# Altium project old_singleboard_now_mcu.PrjPcb (part 1 of 4)
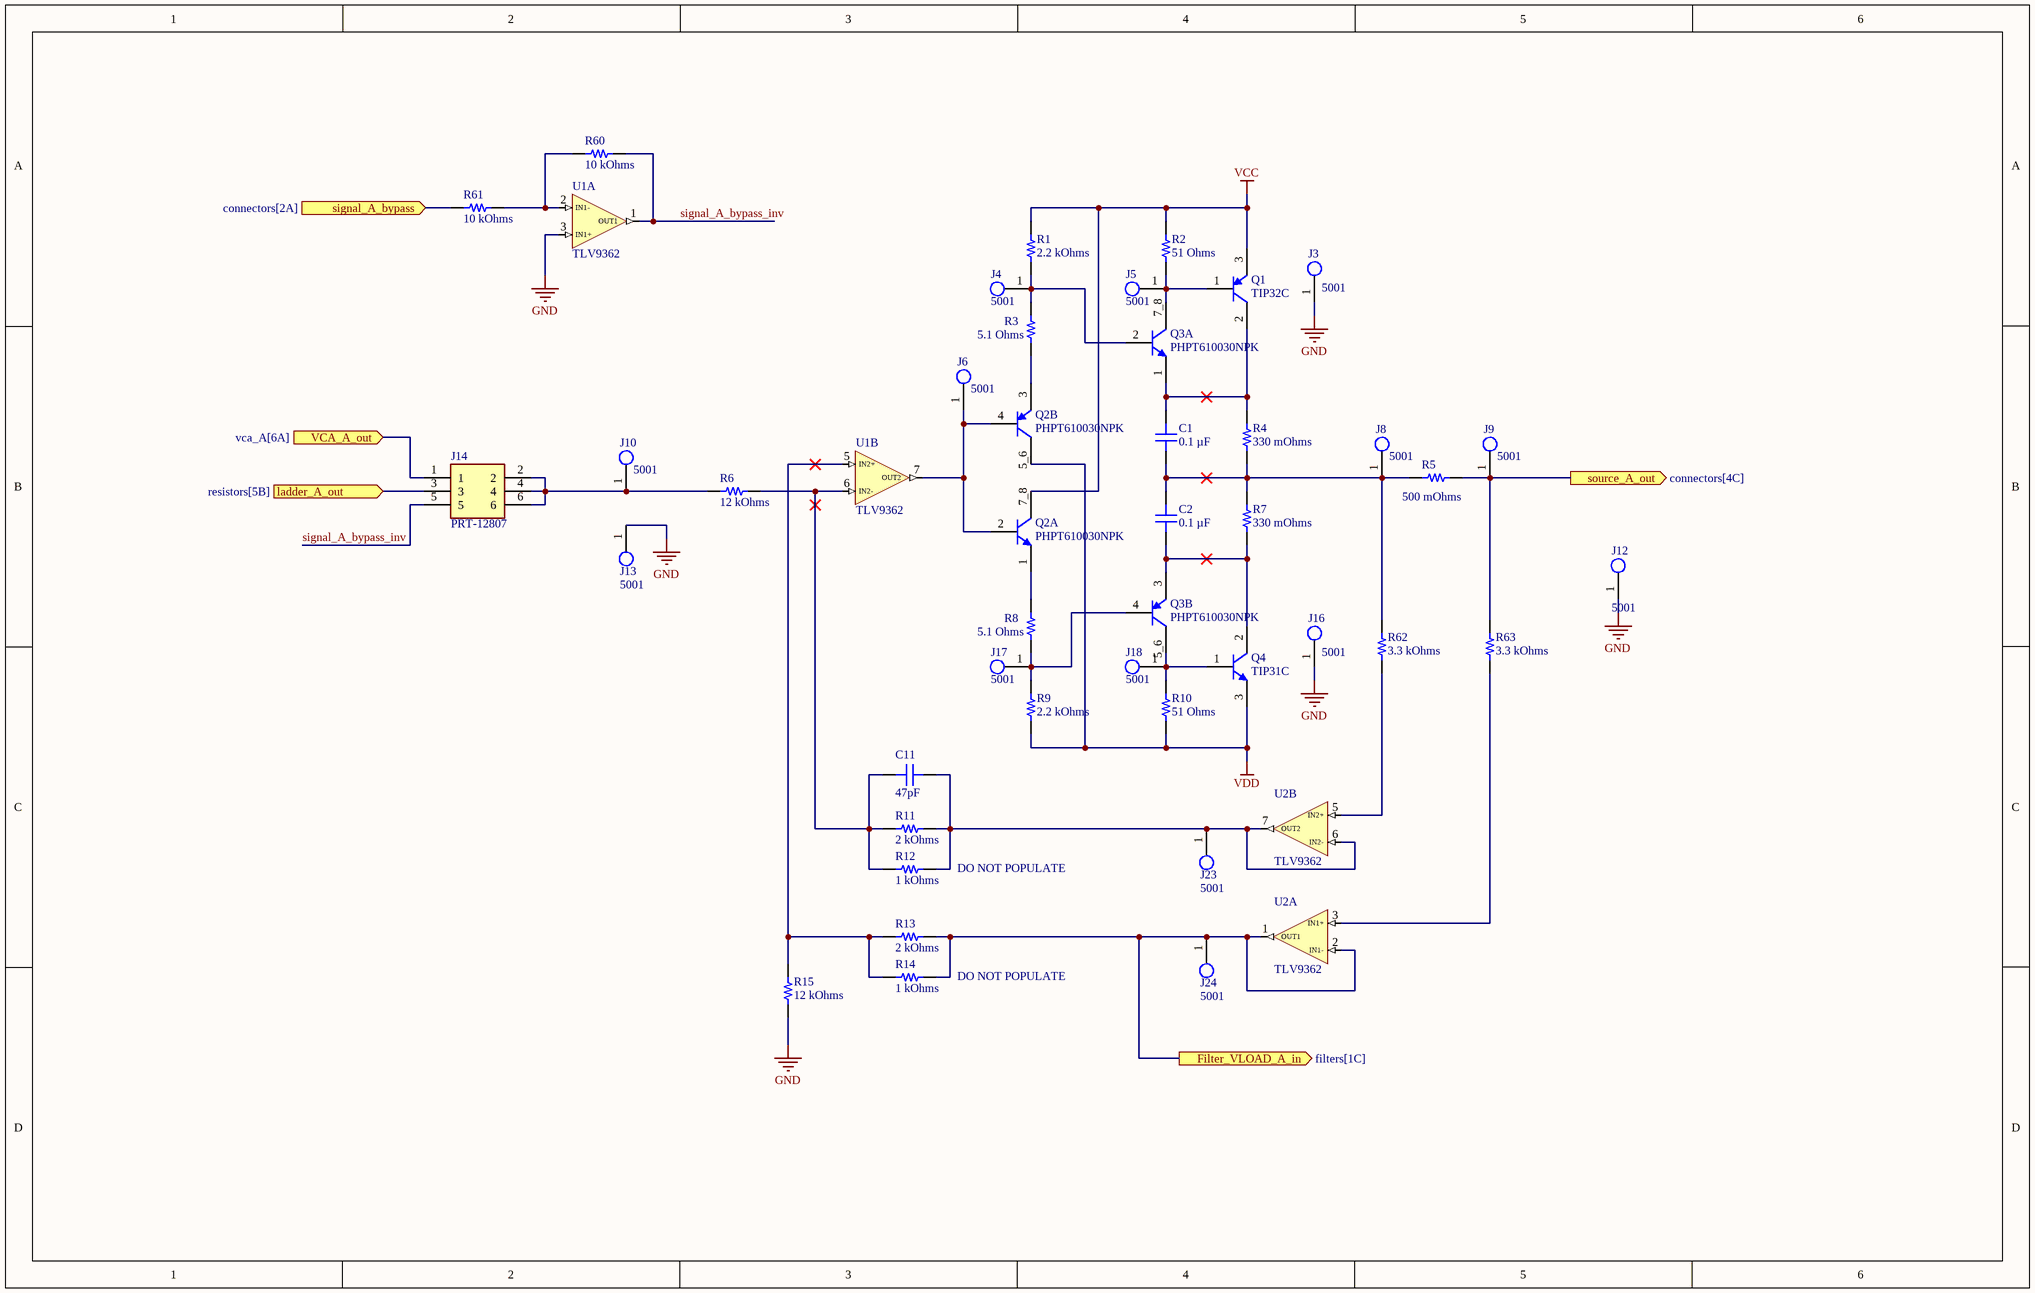
[diagram p0: source_A.SchDoc]
12 sheets, 431 parts. Net scope: flat (ports and power ports of the same name join across sheets).
Board file: source.PcbDoc
Sheets:
  source_A.SchDoc
  source_B.SchDoc
  vca_A.SchDoc
  vca_B.SchDoc
  filters.SchDoc
  power.SchDoc
  MCU.SchDoc
  LDO.SchDoc
  misc.SchDoc
  connectors.SchDoc
  LCD.SchDoc
  resistors.SchDoc

## Sheet source_A.SchDoc
size 381 x 241 mm; SheetNumber: 1; SheetTotal: 12

### Parts
(Parts that share a designator on the sheet are numbered #1, #2 ... from top to bottom, then left to right.)
C1#1  0.1 µF  [CAP 1206_3216 - 0.8MM]
C2#1  0.1 µF  [CAP 1206_3216 - 0.8MM]
C11#1  47pF  [CAP 1206_3216 - 1.8MM]
J3#1  5001  [FP-5001-MFG]
J4#1  5001  [FP-5001-MFG]
J5#1  5001  [FP-5001-MFG]
J6  5001  [FP-5001-MFG]
J8  5001  [FP-5001-MFG]
J9  5001  [FP-5001-MFG]
J10  5001  [FP-5001-MFG]
J12  5001  [FP-5001-MFG]
J13  5001  [FP-5001-MFG]
J14  PRT-12807  [HDRV6W82P254_2X3_762X500X884P]
J16  5001  [FP-5001-MFG]
J17  5001  [FP-5001-MFG]
J18  5001  [FP-5001-MFG]
J23  5001  [FP-5001-MFG]
J24  5001  [FP-5001-MFG]
Q1#1  TIP32C  [ONSC-TO-220-3-221A-09]
Q2#1  PHPT610030NPK  [TRANS_BUK9K18-40E,115]  (parts A,B of 2)
Q3  PHPT610030NPK  [TRANS_BUK9K18-40E,115]  (parts A,B of 2)
Q4  TIP31C  [ONSC-TO-220-3-221A-09]
R1#1  2.2 kOhms  [RES 1206_3216]
R2#1  51 Ohms  [RES 1206_3216]
R3#1  5.1 Ohms  [RES 1206_3216]
R4#1  330 mOhms  [STACKPOLE CSR2512]
R5#1  500 mOhms  [STACKPOLE CSR2512]
R6#1  12 kOhms  [RES 1206_3216]
R7#1  330 mOhms  [STACKPOLE CSR2512]
R8#1  5.1 Ohms  [RES 1206_3216]
R9#1  2.2 kOhms  [RES 1206_3216]
R10#1  51 Ohms  [RES 1206_3216]
R11#1  2 kOhms  [RES 1206_3216]
R12#1  1 kOhms  [RES 1206_3216]
R13#1  2 kOhms  [RES 1206_3216]
R14#1  1 kOhms  [RES 1206_3216]
R15#1  12 kOhms  [RES 1206_3216]
R60  10 kOhms  [YAGEO RES 1206_3216]
R61  10 kOhms  [YAGEO RES 1206_3216]
R62  3.3 kOhms  [YAGEO RES 1206_3216]
R63  3.3 kOhms  [YAGEO RES 1206_3216]
U1#1  TLV9362  [SOIC8-127P600X175-8N]  (parts A,B of 3)
U2#1  TLV9362  [SOIC8-127P600X175-8N]  (parts A,B of 3)

### Ports
Filter_VLOAD_A_in (out, see filters[1C]), ladder_A_out (in, see resistors[5B]), signal_A_bypass (in, see connectors[2A]), source_A_out (out, see connectors[4C]), VCA_A_out (in, see vca_A[6A])

### Nets
GND: J3#1.1 J12.1 J13.1 J16.1 R15#1.1 U1#1.3(IN1+)
VCC: Q1#1.3(E) Q2#1.7_8(C1) R1#1.2 R2#1.2
VDD: Q2#1.5_6(C2) Q4.3(E) R9#1.1 R10#1.1
signal_A_bypass_inv: J14.5 R60.2 U1#1.1(OUT1)
NetC1#1_1: C1#1.1 C2#1.2 J8.1 R4#1.1 R5#1.2 R7#1.2 R62.1
NetC1#1_2: C1#1.2 Q1#1.2(C) Q3.1(E1) R4#1.2
NetC2#1_1: C2#1.1 Q3.3(E2) Q4.2(C) R7#1.1
NetC11#1_1: C11#1.1 R6#1.1 R11#1.1 R12#1.1 U1#1.6(IN2-)
NetC11#1_2: C11#1.2 J23.1 R11#1.2 R12#1.2 U2#1.6(IN2-) U2#1.7(OUT2)
NetD6#2_2: J24.1 R13#1.2 R14#1.2 U2#1.1(OUT1) U2#1.2(IN1-) ; port Filter_VLOAD_A_in
NetD9_2: J9.1 R5#1.1 R63.1 ; port source_A_out
NetJ4#1_1: J4#1.1 Q3.2(B1) R1#1.1 R3#1.2
NetJ5#1_1: J5#1.1 Q1#1.1(B) Q3.7_8(C1) R2#1.1
NetJ6_1: J6.1 Q2#1.2(B1) Q2#1.4(B2) U1#1.7(OUT2)
NetJ10_1: J10.1 J14.2 J14.4 J14.6 R6#1.2
NetJ14_1: J14.1 ; port VCA_A_out
NetJ14_3: J14.3 ; port ladder_A_out
NetJ17_1: J17.1 Q3.4(B2) R8#1.1 R9#1.2
NetJ18_1: J18.1 Q3.5_6(C2) Q4.1(B) R10#1.2
NetJ95_1: R61.2 ; port signal_A_bypass
NetQ2#1_1: Q2#1.1(E1) R8#1.2
NetQ2#1_3: Q2#1.3(E2) R3#1.1
NetR13#1_1: R13#1.1 R14#1.1 R15#1.2 U1#1.5(IN2+)
NetR60_1: R60.1 R61.1 U1#1.2(IN1-)
NetR62_2: R62.2 U2#1.5(IN2+)
NetR63_2: R63.2 U2#1.3(IN1+)

### Notes on the sheet
- DO NOT POPULATE

### Library data of the parts
C1#1 C2#1 = 885012208087: CAP CER 0.1UF 50V X7R 1206; manufacturer: Würth Elektronik; Tolerance: ±10%; Part Number: 885012208087; Capacitance: 0.1 µF; Applications: General Purpose; componentlink1description: Datasheet; componentlink1url: https://katalog.we-online.de/pbs/datasheet/885012208087.pdf; componentlink2description: DigiKey Link; componentlink2url: https://www.digikey.com/en/products/detail/würth-elektronik/885012208087/5453982; Device Package: 1206 (3216 Metric); lastupdated: 6/4/2024 19:10:27; Lifecycle Status: Active; Minimum Order: 1; Mounting Type: Surface Mount, MLCC; Operating Temperature: -55°C ~ 125°C; Package / Case: 1206 (3216 Metric); packaging: TapeAndReel; partid: 20879; Part Status: Active; price: 0.06; series: WCAP-CSGP; Size / Dimension: 0.126" L x 0.063" W (3.20mm x 1.60mm); Supplier 1: DigiKey; Supplier Part Number 1: 732-8127-1-ND; Temperature Coefficient: X7R; Thickness (Max): 0.035" (0.90mm); value: 0.1 µF; Voltage - Rated: 50V
C11#1 = 1206AA470KAT1A: CAP CER 47PF 1KV C0G/NP0 1206; manufacturer: AVX Corporation; Temperature Coefficient: C0G, NP0; Tolerance: ±10%; Voltage - Rated: 1000V (1kV); Part Number: 1206AA470KAT1A; Capacitance: 47pF; Applications: General Purpose; componentlink1description: Datasheet; componentlink1url: http://datasheets.avx.com/AVX-HV_MLCC.pdf; componentlink2description: DigiKey Link; componentlink2url: http://digikey.com/product-detail/en/avx-corporation/1206AA470KAT1A/478-2949-1-ND/808148; Device Package: 1206 (3216 Metric); Features: High Voltage; lastupdated: 9/2/2020 01:05:31; Lifecycle Status: Active; Minimum Order: 1; Mounting Type: Surface Mount, MLCC; Operating Temperature: -55°C ~ 125°C; Package / Case: 1206 (3216 Metric); packaging: TapeAndReel; partid: 21825; Part Status: Active; price: 0.11; series: -; Size / Dimension: 0.130" L x 0.063" W (3.30mm x 1.60mm); Supplier 1: DigiKey; Supplier Part Number 1: 478-2949-1-ND; Thickness (Max): 0.071" (1.80mm); value: 47pF
J3#1 J4#1 J5#1 J6 J8-J10 J12 J13 J16-J18 J23 J24 = CMP-2000-05181-2: PC TEST POINT MINIATURE BLACK; Body Material: Bronze; Plating: Silver; Inside Diameter: 1.27mm; Hole Diameter: 1.6mm; Number of Ports: 1; Outside Diameter: 2.54mm; Insulation: Insulated; Insulation Material: Nylon; Mount: Through Hole; RoHS Compliant: Yes; Series: THM; Height: 0.3inch; Termination: Through Hole; Material: Nylon; Packaging: Bulk; Contact Material: Bronze; REACH SVHC: No SVHC; Contact Plating: Silver; Orientation: Straight; Lead Free: Lead Free; Package Quantity: 100; Length: 7.62mm; Flammability Rating: UL94 V-0; Number of Contacts: 1; Diameter: 2.54mm; Housing Color: Black; Color: Black
J14 = PRT-12807: Connector; Manufacturer_Name: SparkFun; Datasheet Link: https://cdn.sparkfun.com/datasheets/Prototyping/00989.pdf; Height: 8.84mm; Manufacturer_Part_Number: PRT-12807; Mouser Part Number: 474-PRT-12807; Mouser Price/Stock: https://www.mouser.co.uk/ProductDetail/SparkFun/PRT-12807?qs=WyAARYrbSnYnpz4kKzOm4A%3D%3D; Arrow Part Number: PRT-12807; Arrow Price/Stock: https://www.arrow.com/en/products/prt-12807/sparkfun-electronics
Q1#1 = TIP32C: Complementary Silicon Plastic Power Transistor, 3-Pin TO-220, Tube; Manufacturer: On Semiconductor; fT Min (MHz): 3; Polarity: PNP; DatasheetVersion: Rev. 14; PackageVersion: Rev. AG, 09/2011; PackageReference: TO-220-3-221A-09; PackageDescription: 3-Pin Flange Mount, Vertical Straight Lead, Body 9.97 x 4.445 mm, Pitch 2.54 mm; Supplier 1: Digi-Key; Supplier Part Number 1: TIP32COS-ND; IC Continuous (A): 3; Packing: Tube; RoHS: FALSE; Mounting Technology: Through Hole; PartNumber: TIP32C; ComponentLink1Description: Manufacturer URL; ComponentLink1URL: http://www.onsemi.com/; ComponentLink2Description: Datasheet; ComponentLink2URL: http://www.onsemi.com/pub_link/Collateral/TIP31A-D.PDF; ComponentLink3Description: Package Specification; ComponentLink3URL: http://www.onsemi.com/pub_link/Collateral/221A-09.PDF
Q4 = TIP31C: Complementary Silicon Plastic Power Transistor, 3-Pin TO-220, Tube; Manufacturer: On Semiconductor; fT Min (MHz): 3; Polarity: NPN; DatasheetVersion: Rev. 14; PackageVersion: Rev. AG, 09/2011; PackageReference: TO-220-3-221A-09; PackageDescription: 3-Pin Flange Mount, Vertical Straight Lead, Body 9.97 x 4.445 mm, Pitch 2.54 mm; Supplier 1: Digi-Key; Supplier Part Number 1: TIP31COS-ND; IC Continuous (A): 3; Packing: Tube; RoHS: FALSE; Mounting Technology: Through Hole; PartNumber: TIP31C; ComponentLink1Description: Manufacturer URL; ComponentLink1URL: http://www.onsemi.com/; ComponentLink2Description: Datasheet; ComponentLink2URL: http://www.onsemi.com/pub_link/Collateral/TIP31A-D.PDF; ComponentLink3Description: Package Specification; ComponentLink3URL: http://www.onsemi.com/pub_link/Collateral/221A-09.PDF
R1#1 R9#1 = ERJ-8GEYJ222V: RES SMD 2.2K OHM 5% 1/4W 1206; Manufacturer: Panasonic Electronic Components; Power (Watts): 0.25W, 1/4W; Temperature Coefficient: ±200ppm/°C; Part Number: ERJ-8GEYJ222V; ComponentLink1Description: Datasheet; ComponentLink1URL: http://industrial.panasonic.com/www-cgi/jvcr13pz.cgi?E+PZ+3+AOA0001+ERJ8GEYJ222V+7+WW; ComponentLink2Description: DigiKey Link; ComponentLink2URL: https://www.digikey.com/en/products/detail/panasonic-electronic-components/ERJ-8GEYJ222V/10357; Composition: Thick Film; Device Package: 1206 (3216 Metric); Features: Automotive AEC-Q200; Height - Seated (Max): 0.028" (0.70mm); LastUpdated: 2/9/2024 20:54:10; Lifecycle Status: Active; Minimum Order: 1; Number of Terminations: 2; Operating Temperature: -55°C ~ 155°C; Package / Case: 1206 (3216 Metric); Packaging: TapeAndReel; PartId: 35911; Part Status: Active; Price: 0.02; Ratings: AEC-Q200; Resistance: 2.2 kOhms; Series: ERJ-8G; Size / Dimension: 0.126" L x 0.063" W (3.20mm x 1.60mm); Supplier 1: DigiKey; Supplier Part Number 1: P2.2KECT-ND; Supplier Device Package: 1206; Tolerance: ±5%; Value: 2.2 kOhms
R2#1 R10#1 = ERJ-8GEYJ510V: RES SMD 51 OHM 5% 1/4W 1206; Manufacturer: Panasonic Electronic Components; Power (Watts): 0.25W, 1/4W; Temperature Coefficient: ±200ppm/°C; Part Number: ERJ-8GEYJ510V; ComponentLink1Description: Datasheet; ComponentLink1URL: http://industrial.panasonic.com/www-cgi/jvcr13pz.cgi?E+PZ+3+AOA0001+ERJ8GEYJ510V+7+WW; ComponentLink2Description: DigiKey Link; ComponentLink2URL: https://www.digikey.com/en/products/detail/panasonic-electronic-components/ERJ-8GEYJ510V/11678; Composition: Thick Film; Device Package: 1206 (3216 Metric); Features: Automotive AEC-Q200; Height - Seated (Max): 0.028" (0.70mm); LastUpdated: 2/9/2024 20:54:16; Lifecycle Status: Active; Minimum Order: 1; Number of Terminations: 2; Operating Temperature: -55°C ~ 155°C; Package / Case: 1206 (3216 Metric); Packaging: TapeAndReel; PartId: 34147; Part Status: Active; Price: 0.02; Ratings: AEC-Q200; Resistance: 51 Ohms; Series: ERJ-8G; Size / Dimension: 0.126" L x 0.063" W (3.20mm x 1.60mm); Supplier 1: DigiKey; Supplier Part Number 1: P51ECT-ND; Supplier Device Package: 1206; Tolerance: ±5%; Value: 51 Ohms
R3#1 R8#1 = ERJ-8GEYJ5R1V: RES SMD 5.1 OHM 5% 1/4W 1206; Manufacturer: Panasonic Electronic Components; Power (Watts): 0.25W, 1/4W; Temperature Coefficient: -100/ +600ppm/°C; Part Number: ERJ-8GEYJ5R1V; ComponentLink1Description: Datasheet; ComponentLink1URL: http://industrial.panasonic.com/www-cgi/jvcr13pz.cgi?E+PZ+3+AOA0001+ERJ8GEYJ5R1V+7+WW; ComponentLink2Description: DigiKey Link; ComponentLink2URL: https://www.digikey.com/en/products/detail/panasonic-electronic-components/ERJ-8GEYJ5R1V/282211; Composition: Thick Film; Device Package: 1206 (3216 Metric); Features: Automotive AEC-Q200; Height - Seated (Max): 0.028" (0.70mm); LastUpdated: 2/9/2024 20:54:09; Lifecycle Status: Active; Minimum Order: 1; Number of Terminations: 2; Operating Temperature: -55°C ~ 155°C; Package / Case: 1206 (3216 Metric); Packaging: TapeAndReel; PartId: 36042; Part Status: Active; Price: 0.02; Ratings: AEC-Q200; Resistance: 5.1 Ohms; Series: ERJ-8G; Size / Dimension: 0.126" L x 0.063" W (3.20mm x 1.60mm); Supplier 1: DigiKey; Supplier Part Number 1: P5.1ECT-ND; Supplier Device Package: 1206; Tolerance: ±5%; Value: 5.1 Ohms
R4#1 R7#1 = CSRN2512FKR330: RES 0.33 OHM 1% 2W 2512; Manufacturer: Stackpole Electronics Inc; Temperature Coefficient: ±200ppm/°C; Part Number: CSRN2512FKR330; Package / Case: 2512 (6432 Metric); ComponentLink1Description: Datasheet; ComponentLink1URL: https://www.seielect.com/catalog/sei-csr_csrn.pdf; ComponentLink2Description: DigiKey Link; ComponentLink2URL: https://www.digikey.com/en/products/detail/stackpole-electronics-inc/CSRN2512FKR330/1742756; Composition: Thick Film; Device Package: 2512 (6432 Metric); Features: Current Sense; Height - Seated (Max): 0.028" (0.70mm); LastUpdated: 2/17/2022 18:43:57; Lifecycle Status: Active; Minimum Order: 1; Number of Terminations: 2; Operating Temperature: -55°C ~ 155°C; Packaging: TapeAndReel; PartId: 1770; Part Status: Active; Power (Watts): 2W; Price: 0.12; Resistance: 330 mOhms; Series: CSRN; Size / Dimension: 0.250" L x 0.124" W (6.35mm x 3.15mm); Supplier 1: DigiKey; Supplier Part Number 1: CSRN2512FKR330CT-ND; Supplier Device Package: 2512; Tolerance: ±1%; Value: 330 mOhms
R5#1 = CSRN2512FKR500: RES 0.5 OHM 1% 2W 2512; Manufacturer: Stackpole Electronics Inc; Temperature Coefficient: ±200ppm/°C; Part Number: CSRN2512FKR500; Package / Case: 2512 (6432 Metric); ComponentLink1Description: Datasheet; ComponentLink1URL: https://www.seielect.com/catalog/sei-csr_csrn.pdf; ComponentLink2Description: DigiKey Link; ComponentLink2URL: https://www.digikey.com/en/products/detail/stackpole-electronics-inc/CSRN2512FKR500/1742768; Composition: Thick Film; Device Package: 2512 (6432 Metric); Features: Current Sense; Height - Seated (Max): 0.028" (0.70mm); LastUpdated: 2/17/2022 18:43:58; Lifecycle Status: Active; Minimum Order: 1; Number of Terminations: 2; Operating Temperature: -55°C ~ 155°C; Packaging: TapeAndReel; PartId: 1683; Part Status: Active; Power (Watts): 2W; Price: 0.07; Resistance: 500 mOhms; Series: CSRN; Size / Dimension: 0.250" L x 0.124" W (6.35mm x 3.15mm); Supplier 1: DigiKey; Supplier Part Number 1: CSRN2512FKR500CT-ND; Supplier Device Package: 2512; Tolerance: ±1%; Value: 500 mOhms
R6#1 R15#1 = ERA-8AEB123V: RES SMD 12K OHM 0.1% 1/4W 1206; Manufacturer: Panasonic Electronic Components; Power (Watts): 0.25W, 1/4W; Temperature Coefficient: ±25ppm/°C; Part Number: ERA-8AEB123V; ComponentLink1Description: Datasheet; ComponentLink1URL: https://industrial.panasonic.com/cdbs/www-data/pdf/RDM0000/AOA0000C307.pdf; ComponentLink2Description: DigiKey Link; ComponentLink2URL: https://www.digikey.com/en/products/detail/panasonic-electronic-components/ERA-8AEB123V/3070775; Composition: Thin Film; Device Package: 1206 (3216 Metric); Features: Automotive AEC-Q200; Height - Seated (Max): 0.028" (0.70mm); LastUpdated: 2/9/2024 20:53:53; Lifecycle Status: Active; Minimum Order: 1; Number of Terminations: 2; Operating Temperature: -55°C ~ 155°C; Package / Case: 1206 (3216 Metric); Packaging: TapeAndReel; PartId: 40988; Part Status: Active; Price: 0.10; Ratings: AEC-Q200; Resistance: 12 kOhms; Series: ERA-8A; Size / Dimension: 0.126" L x 0.063" W (3.20mm x 1.60mm); Supplier 1: DigiKey; Supplier Part Number 1: 10-ERA-8AEB123VCT-ND; Supplier Device Package: 1206; Tolerance: ±0.1%; Value: 12 kOhms
R11#1 R13#1 = ERA-8AEB202V: RES SMD 2K OHM 0.1% 1/4W 1206; Manufacturer: Panasonic Electronic Components; Power (Watts): 0.25W, 1/4W; Temperature Coefficient: ±25ppm/°C; Part Number: ERA-8AEB202V; ComponentLink1Description: Datasheet; ComponentLink1URL: https://industrial.panasonic.com/cdbs/www-data/pdf/RDM0000/AOA0000C307.pdf; ComponentLink2Description: DigiKey Link; ComponentLink2URL: https://www.digikey.com/en/products/detail/panasonic-electronic-components/ERA-8AEB202V/3070866; Composition: Thin Film; Device Package: 1206 (3216 Metric); Features: Automotive AEC-Q200; Height - Seated (Max): 0.028" (0.70mm); LastUpdated: 2/9/2024 20:54:17; Lifecycle Status: Active; Minimum Order: 1; Number of Terminations: 2; Operating Temperature: -55°C ~ 155°C; Package / Case: 1206 (3216 Metric); Packaging: TapeAndReel; PartId: 34011; Part Status: Active; Price: 0.10; Ratings: AEC-Q200; Resistance: 2 kOhms; Series: ERA-8A; Size / Dimension: 0.126" L x 0.063" W (3.20mm x 1.60mm); Supplier 1: DigiKey; Supplier Part Number 1: P2.0KBCCT-ND; Supplier Device Package: 1206; Tolerance: ±0.1%; Value: 2 kOhms
R12#1 R14#1 = ERA-8AEB102V: RES SMD 1K OHM 0.1% 1/4W 1206; Manufacturer: Panasonic Electronic Components; Power (Watts): 0.25W, 1/4W; Temperature Coefficient: ±25ppm/°C; Part Number: ERA-8AEB102V; ComponentLink1Description: Datasheet; ComponentLink1URL: https://industrial.panasonic.com/cdbs/www-data/pdf/RDM0000/AOA0000C307.pdf; ComponentLink2Description: DigiKey Link; ComponentLink2URL: https://www.digikey.com/en/products/detail/panasonic-electronic-components/ERA-8AEB102V/3070741; Composition: Thin Film; Device Package: 1206 (3216 Metric); Features: Automotive AEC-Q200; Height - Seated (Max): 0.028" (0.70mm); LastUpdated: 2/9/2024 20:54:17; Lifecycle Status: Active; Minimum Order: 1; Number of Terminations: 2; Operating Temperature: -55°C ~ 155°C; Package / Case: 1206 (3216 Metric); Packaging: TapeAndReel; PartId: 33986; Part Status: Active; Price: 0.10; Ratings: AEC-Q200; Resistance: 1 kOhms; Series: ERA-8A; Size / Dimension: 0.126" L x 0.063" W (3.20mm x 1.60mm); Supplier 1: DigiKey; Supplier Part Number 1: P1.0KBCCT-ND; Supplier Device Package: 1206; Tolerance: ±0.1%; Value: 1 kOhms
R60 R61 = RT1206FRE0710KL: RES SMD 10K OHM 1% 1/4W 1206; Manufacturer: Yageo; Power (Watts): 0.25W, 1/4W; Temperature Coefficient: ±50ppm/°C; Part Number: RT1206FRE0710KL; ComponentLink1Description: Datasheet; ComponentLink1URL: https://www.yageo.com/upload/media/product/productsearch/datasheet/rchip/PYu-RT_1-to-0.01_RoHS_L_11.pdf; ComponentLink2Description: DigiKey Link; ComponentLink2URL: https://www.digikey.com/en/products/detail/yageo/RT1206FRE0710KL/1082868; Composition: Thin Film; Device Package: 1206 (3216 Metric); Height - Seated (Max): 0.026" (0.65mm); LastUpdated: 7/25/2024 09:21:28; Lifecycle Status: Active; Minimum Order: 1; Number of Terminations: 2; Operating Temperature: -55°C ~ 155°C; Package / Case: 1206 (3216 Metric); Packaging: TapeAndReel; PartId: 38903; Part Status: Active; Price: 0.01; Resistance: 10 kOhms; Series: RT; Size / Dimension: 0.122" L x 0.063" W (3.10mm x 1.60mm); Supplier 1: DigiKey; Supplier Part Number 1: YAG1242CT-ND; Supplier Device Package: 1206; Tolerance: ±1%; Value: 10 kOhms
R62 R63 = RT1206FRE073K3L: RES SMD 3.3K OHM 1% 1/4W 1206; Manufacturer: Yageo; Power (Watts): 0.25W, 1/4W; Temperature Coefficient: ±50ppm/°C; Part Number: RT1206FRE073K3L; ComponentLink1Description: Datasheet; ComponentLink1URL: https://www.yageo.com/upload/media/product/productsearch/datasheet/rchip/PYu-RT_1-to-0.01_RoHS_L_12.pdf; ComponentLink2Description: DigiKey Link; ComponentLink2URL: https://www.digikey.com/en/products/detail/yageo/RT1206FRE073K3L/1083187; Composition: Thin Film; Device Package: 1206 (3216 Metric); Height - Seated (Max): 0.026" (0.65mm); LastUpdated: 7/25/2024 09:21:22; Lifecycle Status: Active; Minimum Order: 1; Number of Terminations: 2; Operating Temperature: -55°C ~ 155°C; Package / Case: 1206 (3216 Metric); Packaging: TapeAndReel; PartId: 58380; Part Status: Active; Price: 0.01; Resistance: 3.3 kOhms; Series: RT; Size / Dimension: 0.122" L x 0.063" W (3.10mm x 1.60mm); Supplier 1: DigiKey; Supplier Part Number 1: 13-RT1206FRE073K3LCT-ND; Supplier Device Package: 1206; Tolerance: ±1%; Value: 3.3 kOhms
U1#1 U2#1 = TLV9362: TLV936x 10-MHz, 40-V, RRO, Operational Amplifie; ComponentLink1Description: Datasheet; ComponentLink1URL: https://www.ti.com/lit/ds/symlink/tlv9362.pdf
Q2#1 Q3 = PHPT610030NPK: ComponentLink1Description: Datasheet; ComponentLink1URL: https://assets.nexperia.com/documents/data-sheet/PHPT610030NPK.pdf; ComponentLink2Description: Supplier; ComponentLink2URL: https://hr.mouser.com/ProductDetail/Nexperia/PHPT610030NPKX?qs=%252BRKXB2WKlSeoXKhT5DAScw%3D%3D

## Sheet source_B.SchDoc
size 381 x 241 mm; SheetNumber: 2; SheetTotal: 12
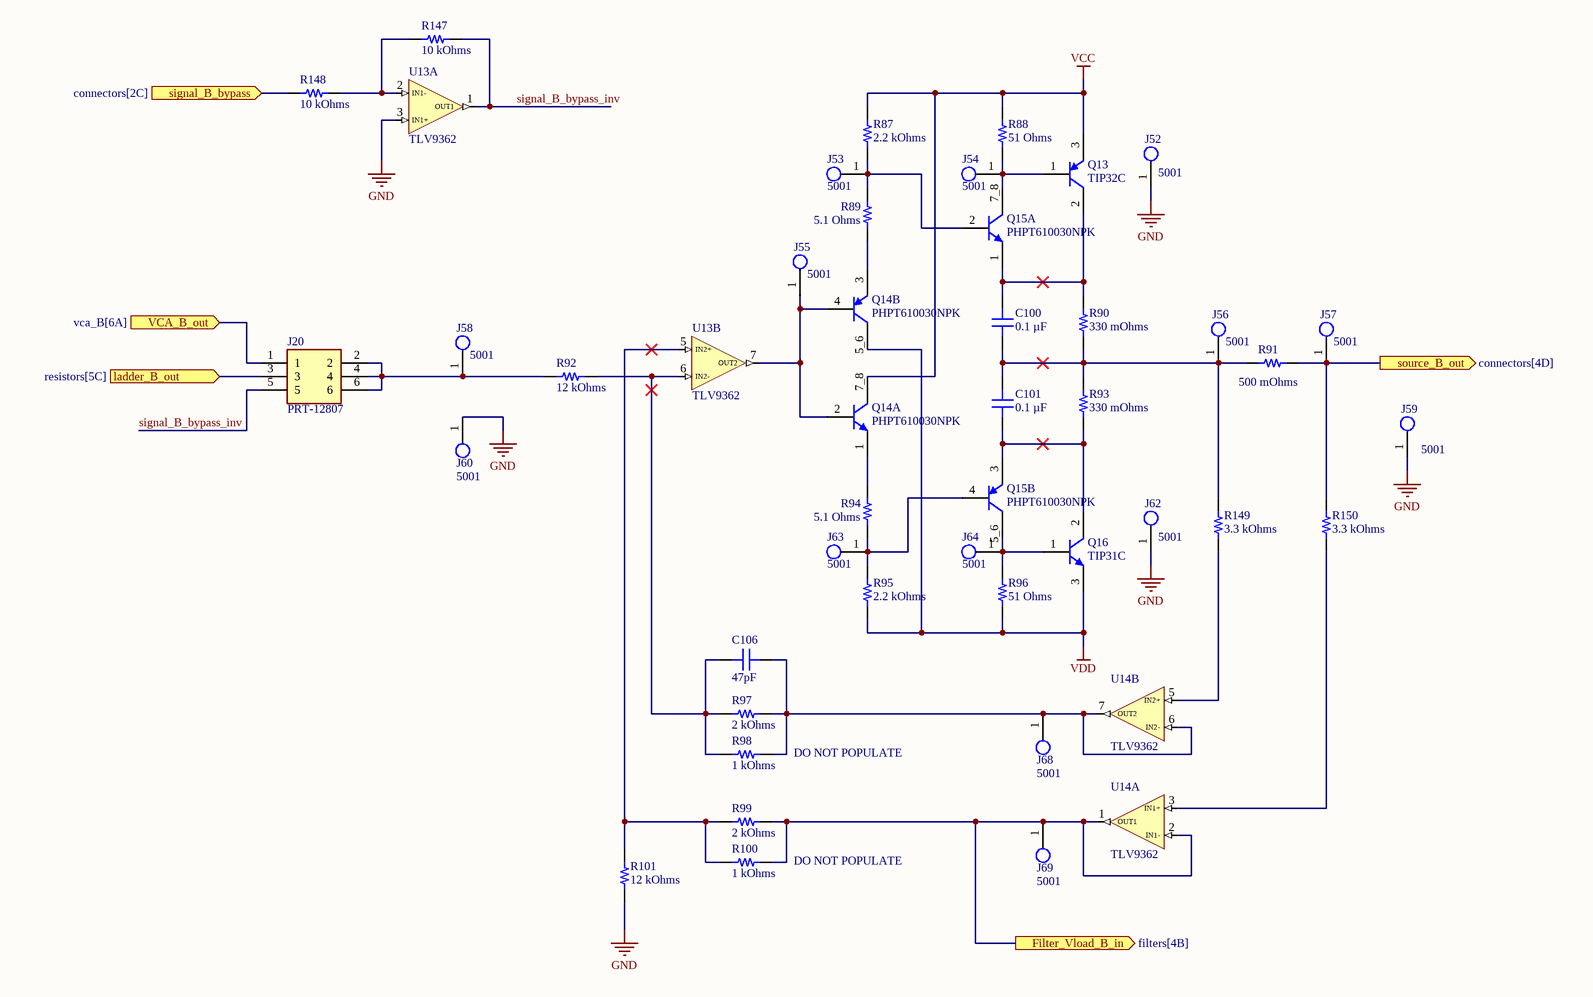
[diagram p1: source_B.SchDoc]

### Parts
C100  0.1 µF  [CAP 1206_3216 - 0.8MM]
C101  0.1 µF  [CAP 1206_3216 - 0.8MM]
C106  47pF  [CAP 1206_3216 - 1.8MM]
J20  PRT-12807  [HDRV6W82P254_2X3_762X500X884P]
J52  5001  [FP-5001-MFG]
J53  5001  [FP-5001-MFG]
J54  5001  [FP-5001-MFG]
J55  5001  [FP-5001-MFG]
J56  5001  [FP-5001-MFG]
J57  5001  [FP-5001-MFG]
J58  5001  [FP-5001-MFG]
J59  5001  [FP-5001-MFG]
J60  5001  [FP-5001-MFG]
J62  5001  [FP-5001-MFG]
J63  5001  [FP-5001-MFG]
J64  5001  [FP-5001-MFG]
J68  5001  [FP-5001-MFG]
J69  5001  [FP-5001-MFG]
Q13  TIP32C  [ONSC-TO-220-3-221A-09]
Q14  PHPT610030NPK  [TRANS_BUK9K18-40E,115]  (parts A,B of 2)
Q15  PHPT610030NPK  [TRANS_BUK9K18-40E,115]  (parts A,B of 2)
Q16  TIP31C  [ONSC-TO-220-3-221A-09]
R87  2.2 kOhms  [RES 1206_3216]
R88  51 Ohms  [RES 1206_3216]
R89  5.1 Ohms  [RES 1206_3216]
R90  330 mOhms  [STACKPOLE CSR2512]
R91  500 mOhms  [STACKPOLE CSR2512]
R92  12 kOhms  [RES 1206_3216]
R93  330 mOhms  [STACKPOLE CSR2512]
R94  5.1 Ohms  [RES 1206_3216]
R95  2.2 kOhms  [RES 1206_3216]
R96  51 Ohms  [RES 1206_3216]
R97  2 kOhms  [RES 1206_3216]
R98  1 kOhms  [RES 1206_3216]
R99  2 kOhms  [RES 1206_3216]
R100  1 kOhms  [RES 1206_3216]
R101  12 kOhms  [RES 1206_3216]
R147  10 kOhms  [YAGEO RES 1206_3216]
R148  10 kOhms  [YAGEO RES 1206_3216]
R149  3.3 kOhms  [YAGEO RES 1206_3216]
R150  3.3 kOhms  [YAGEO RES 1206_3216]
U13  TLV9362  [SOIC8-127P600X175-8N]  (parts A,B of 3)
U14  TLV9362  [SOIC8-127P600X175-8N]  (parts A,B of 3)

### Ports
Filter_Vload_B_in (out, see filters[4B]), ladder_B_out (in, see resistors[5C]), signal_B_bypass (in, see connectors[2C]), source_B_out (out, see connectors[4D]), VCA_B_out (in, see vca_B[6A])

### Nets
GND: J52.1 J59.1 J60.1 J62.1 R101.1 U13.3(IN1+)
VCC: Q13.3(E) Q14.7_8(C1) R87.2 R88.2
VDD: Q14.5_6(C2) Q16.3(E) R95.1 R96.1
signal_B_bypass_inv: J20.5 R147.2 U13.1(OUT1)
NetC100_1: C100.1 C101.2 J56.1 R90.1 R91.2 R93.2 R149.1
NetC100_2: C100.2 Q13.2(C) Q15.1(E1) R90.2
NetC101_1: C101.1 Q15.3(E2) Q16.2(C) R93.1
NetC106_1: C106.1 R92.1 R97.1 R98.1 U13.6(IN2-)
NetC106_2: C106.2 J68.1 R97.2 R98.2 U14.6(IN2-) U14.7(OUT2)
NetD5#1_2: J69.1 R99.2 R100.2 U14.1(OUT1) U14.2(IN1-) ; port Filter_Vload_B_in
NetD10_2: J57.1 R91.1 R150.1 ; port source_B_out
NetJ20_1: J20.1 ; port VCA_B_out
NetJ20_2: J20.2 J20.4 J20.6 J58.1 R92.2
NetJ20_3: J20.3 ; port ladder_B_out
NetJ53_1: J53.1 Q15.2(B1) R87.1 R89.2
NetJ54_1: J54.1 Q13.1(B) Q15.7_8(C1) R88.1
NetJ55_1: J55.1 Q14.2(B1) Q14.4(B2) U13.7(OUT2)
NetJ63_1: J63.1 Q15.4(B2) R94.1 R95.2
NetJ64_1: J64.1 Q15.5_6(C2) Q16.1(B) R96.2
NetJ96_1: R148.2 ; port signal_B_bypass
NetQ14_1: Q14.1(E1) R94.2
NetQ14_3: Q14.3(E2) R89.1
NetR99_1: R99.1 R100.1 R101.2 U13.5(IN2+)
NetR147_1: R147.1 R148.1 U13.2(IN1-)
NetR149_2: R149.2 U14.5(IN2+)
NetR150_2: R150.2 U14.3(IN1+)

### Notes on the sheet
- DO NOT POPULATE

### Library data of the parts
C100 C101 = 885012208087: as C1#1 on sheet source_A; Part Number: 885012208087; Capacitance: 0.1 µF; Applications: General Purpose; componentlink1description: Datasheet; componentlink1url: https://katalog.we-online.de/pbs/datasheet/885012208087.pdf; componentlink2description: DigiKey Link; componentlink2url: https://www.digikey.com/en/products/detail/würth-elektronik/885012208087/5453982; Device Package: 1206 (3216 Metric); lastupdated: 6/4/2024 19:10:27; Lifecycle Status: Active; Minimum Order: 1; Mounting Type: Surface Mount, MLCC; Operating Temperature: -55°C ~ 125°C; Package / Case: 1206 (3216 Metric); packaging: TapeAndReel; partid: 20879; Part Status: Active; price: 0.06; series: WCAP-CSGP; Size / Dimension: 0.126" L x 0.063" W (3.20mm x 1.60mm); Supplier 1: DigiKey; Supplier Part Number 1: 732-8127-1-ND; Temperature Coefficient: X7R; Thickness (Max): 0.035" (0.90mm); value: 0.1 µF; Voltage - Rated: 50V
C106 = 1206AA470KAT1A: as C11#1 on sheet source_A; Part Number: 1206AA470KAT1A; Capacitance: 47pF; Applications: General Purpose; componentlink1description: Datasheet; componentlink1url: http://datasheets.avx.com/AVX-HV_MLCC.pdf; componentlink2description: DigiKey Link; componentlink2url: http://digikey.com/product-detail/en/avx-corporation/1206AA470KAT1A/478-2949-1-ND/808148; Device Package: 1206 (3216 Metric); Features: High Voltage; lastupdated: 9/2/2020 01:05:31; Lifecycle Status: Active; Minimum Order: 1; Mounting Type: Surface Mount, MLCC; Operating Temperature: -55°C ~ 125°C; Package / Case: 1206 (3216 Metric); packaging: TapeAndReel; partid: 21825; Part Status: Active; price: 0.11; series: -; Size / Dimension: 0.130" L x 0.063" W (3.30mm x 1.60mm); Supplier 1: DigiKey; Supplier Part Number 1: 478-2949-1-ND; Thickness (Max): 0.071" (1.80mm); value: 47pF
J20 = PRT-12807: Connector; Manufacturer_Name: SparkFun; Datasheet Link: https://cdn.sparkfun.com/datasheets/Prototyping/00989.pdf; Height: 8.84mm; Manufacturer_Part_Number: PRT-12807; Mouser Part Number: 474-PRT-12807; Mouser Price/Stock: https://www.mouser.co.uk/ProductDetail/SparkFun/PRT-12807?qs=WyAARYrbSnYnpz4kKzOm4A%3D%3D; Arrow Part Number: PRT-12807; Arrow Price/Stock: https://www.arrow.com/en/products/prt-12807/sparkfun-electronics
J52-J60 J62-J64 J68 J69 = CMP-2000-05181-2: as J3#1 on sheet source_A; Insulation Material: Nylon; Mount: Through Hole; RoHS Compliant: Yes; Series: THM; Height: 0.3inch; Termination: Through Hole; Material: Nylon; Packaging: Bulk; Contact Material: Bronze; REACH SVHC: No SVHC; Contact Plating: Silver; Orientation: Straight; Lead Free: Lead Free; Package Quantity: 100; Length: 7.62mm; Flammability Rating: UL94 V-0; Number of Contacts: 1; Diameter: 2.54mm; Housing Color: Black; Color: Black
Q13 = TIP32C: as Q1#1 on sheet source_A; DatasheetVersion: Rev. 14; PackageVersion: Rev. AG, 09/2011; PackageReference: TO-220-3-221A-09; PackageDescription: 3-Pin Flange Mount, Vertical Straight Lead, Body 9.97 x 4.445 mm, Pitch 2.54 mm; Supplier 1: Digi-Key; Supplier Part Number 1: TIP32COS-ND; IC Continuous (A): 3; Packing: Tube; RoHS: FALSE; Mounting Technology: Through Hole; PartNumber: TIP32C; ComponentLink1Description: Manufacturer URL; ComponentLink1URL: http://www.onsemi.com/; ComponentLink2Description: Datasheet; ComponentLink2URL: http://www.onsemi.com/pub_link/Collateral/TIP31A-D.PDF; ComponentLink3Description: Package Specification; ComponentLink3URL: http://www.onsemi.com/pub_link/Collateral/221A-09.PDF
Q16 = TIP31C: as Q4 on sheet source_A; DatasheetVersion: Rev. 14; PackageVersion: Rev. AG, 09/2011; PackageReference: TO-220-3-221A-09; PackageDescription: 3-Pin Flange Mount, Vertical Straight Lead, Body 9.97 x 4.445 mm, Pitch 2.54 mm; Supplier 1: Digi-Key; Supplier Part Number 1: TIP31COS-ND; IC Continuous (A): 3; Packing: Tube; RoHS: FALSE; Mounting Technology: Through Hole; PartNumber: TIP31C; ComponentLink1Description: Manufacturer URL; ComponentLink1URL: http://www.onsemi.com/; ComponentLink2Description: Datasheet; ComponentLink2URL: http://www.onsemi.com/pub_link/Collateral/TIP31A-D.PDF; ComponentLink3Description: Package Specification; ComponentLink3URL: http://www.onsemi.com/pub_link/Collateral/221A-09.PDF
R87 R95 = ERJ-8GEYJ222V: as R1#1 on sheet source_A; Part Number: ERJ-8GEYJ222V; ComponentLink1Description: Datasheet; ComponentLink1URL: http://industrial.panasonic.com/www-cgi/jvcr13pz.cgi?E+PZ+3+AOA0001+ERJ8GEYJ222V+7+WW; ComponentLink2Description: DigiKey Link; ComponentLink2URL: https://www.digikey.com/en/products/detail/panasonic-electronic-components/ERJ-8GEYJ222V/10357; Composition: Thick Film; Device Package: 1206 (3216 Metric); Features: Automotive AEC-Q200; Height - Seated (Max): 0.028" (0.70mm); LastUpdated: 2/9/2024 20:54:10; Lifecycle Status: Active; Minimum Order: 1; Number of Terminations: 2; Operating Temperature: -55°C ~ 155°C; Package / Case: 1206 (3216 Metric); Packaging: TapeAndReel; PartId: 35911; Part Status: Active; Price: 0.02; Ratings: AEC-Q200; Resistance: 2.2 kOhms; Series: ERJ-8G; Size / Dimension: 0.126" L x 0.063" W (3.20mm x 1.60mm); Supplier 1: DigiKey; Supplier Part Number 1: P2.2KECT-ND; Supplier Device Package: 1206; Tolerance: ±5%; Value: 2.2 kOhms
R88 R96 = ERJ-8GEYJ510V: as R2#1 on sheet source_A; Part Number: ERJ-8GEYJ510V; ComponentLink1Description: Datasheet; ComponentLink1URL: http://industrial.panasonic.com/www-cgi/jvcr13pz.cgi?E+PZ+3+AOA0001+ERJ8GEYJ510V+7+WW; ComponentLink2Description: DigiKey Link; ComponentLink2URL: https://www.digikey.com/en/products/detail/panasonic-electronic-components/ERJ-8GEYJ510V/11678; Composition: Thick Film; Device Package: 1206 (3216 Metric); Features: Automotive AEC-Q200; Height - Seated (Max): 0.028" (0.70mm); LastUpdated: 2/9/2024 20:54:16; Lifecycle Status: Active; Minimum Order: 1; Number of Terminations: 2; Operating Temperature: -55°C ~ 155°C; Package / Case: 1206 (3216 Metric); Packaging: TapeAndReel; PartId: 34147; Part Status: Active; Price: 0.02; Ratings: AEC-Q200; Resistance: 51 Ohms; Series: ERJ-8G; Size / Dimension: 0.126" L x 0.063" W (3.20mm x 1.60mm); Supplier 1: DigiKey; Supplier Part Number 1: P51ECT-ND; Supplier Device Package: 1206; Tolerance: ±5%; Value: 51 Ohms
R89 R94 = ERJ-8GEYJ5R1V: as R3#1 on sheet source_A; Part Number: ERJ-8GEYJ5R1V; ComponentLink1Description: Datasheet; ComponentLink1URL: http://industrial.panasonic.com/www-cgi/jvcr13pz.cgi?E+PZ+3+AOA0001+ERJ8GEYJ5R1V+7+WW; ComponentLink2Description: DigiKey Link; ComponentLink2URL: https://www.digikey.com/en/products/detail/panasonic-electronic-components/ERJ-8GEYJ5R1V/282211; Composition: Thick Film; Device Package: 1206 (3216 Metric); Features: Automotive AEC-Q200; Height - Seated (Max): 0.028" (0.70mm); LastUpdated: 2/9/2024 20:54:09; Lifecycle Status: Active; Minimum Order: 1; Number of Terminations: 2; Operating Temperature: -55°C ~ 155°C; Package / Case: 1206 (3216 Metric); Packaging: TapeAndReel; PartId: 36042; Part Status: Active; Price: 0.02; Ratings: AEC-Q200; Resistance: 5.1 Ohms; Series: ERJ-8G; Size / Dimension: 0.126" L x 0.063" W (3.20mm x 1.60mm); Supplier 1: DigiKey; Supplier Part Number 1: P5.1ECT-ND; Supplier Device Package: 1206; Tolerance: ±5%; Value: 5.1 Ohms
R90 R93 = CSRN2512FKR330: as R4#1 on sheet source_A; Part Number: CSRN2512FKR330; Package / Case: 2512 (6432 Metric); ComponentLink1Description: Datasheet; ComponentLink1URL: https://www.seielect.com/catalog/sei-csr_csrn.pdf; ComponentLink2Description: DigiKey Link; ComponentLink2URL: https://www.digikey.com/en/products/detail/stackpole-electronics-inc/CSRN2512FKR330/1742756; Composition: Thick Film; Device Package: 2512 (6432 Metric); Features: Current Sense; Height - Seated (Max): 0.028" (0.70mm); LastUpdated: 2/17/2022 18:43:57; Lifecycle Status: Active; Minimum Order: 1; Number of Terminations: 2; Operating Temperature: -55°C ~ 155°C; Packaging: TapeAndReel; PartId: 1770; Part Status: Active; Power (Watts): 2W; Price: 0.12; Resistance: 330 mOhms; Series: CSRN; Size / Dimension: 0.250" L x 0.124" W (6.35mm x 3.15mm); Supplier 1: DigiKey; Supplier Part Number 1: CSRN2512FKR330CT-ND; Supplier Device Package: 2512; Tolerance: ±1%; Value: 330 mOhms
R91 = CSRN2512FKR500: as R5#1 on sheet source_A; Part Number: CSRN2512FKR500; Package / Case: 2512 (6432 Metric); ComponentLink1Description: Datasheet; ComponentLink1URL: https://www.seielect.com/catalog/sei-csr_csrn.pdf; ComponentLink2Description: DigiKey Link; ComponentLink2URL: https://www.digikey.com/en/products/detail/stackpole-electronics-inc/CSRN2512FKR500/1742768; Composition: Thick Film; Device Package: 2512 (6432 Metric); Features: Current Sense; Height - Seated (Max): 0.028" (0.70mm); LastUpdated: 2/17/2022 18:43:58; Lifecycle Status: Active; Minimum Order: 1; Number of Terminations: 2; Operating Temperature: -55°C ~ 155°C; Packaging: TapeAndReel; PartId: 1683; Part Status: Active; Power (Watts): 2W; Price: 0.07; Resistance: 500 mOhms; Series: CSRN; Size / Dimension: 0.250" L x 0.124" W (6.35mm x 3.15mm); Supplier 1: DigiKey; Supplier Part Number 1: CSRN2512FKR500CT-ND; Supplier Device Package: 2512; Tolerance: ±1%; Value: 500 mOhms
R92 R101 = ERA-8AEB123V: as R6#1 on sheet source_A; Part Number: ERA-8AEB123V; ComponentLink1Description: Datasheet; ComponentLink1URL: https://industrial.panasonic.com/cdbs/www-data/pdf/RDM0000/AOA0000C307.pdf; ComponentLink2Description: DigiKey Link; ComponentLink2URL: https://www.digikey.com/en/products/detail/panasonic-electronic-components/ERA-8AEB123V/3070775; Composition: Thin Film; Device Package: 1206 (3216 Metric); Features: Automotive AEC-Q200; Height - Seated (Max): 0.028" (0.70mm); LastUpdated: 2/9/2024 20:53:53; Lifecycle Status: Active; Minimum Order: 1; Number of Terminations: 2; Operating Temperature: -55°C ~ 155°C; Package / Case: 1206 (3216 Metric); Packaging: TapeAndReel; PartId: 40988; Part Status: Active; Price: 0.10; Ratings: AEC-Q200; Resistance: 12 kOhms; Series: ERA-8A; Size / Dimension: 0.126" L x 0.063" W (3.20mm x 1.60mm); Supplier 1: DigiKey; Supplier Part Number 1: 10-ERA-8AEB123VCT-ND; Supplier Device Package: 1206; Tolerance: ±0.1%; Value: 12 kOhms
R97 R99 = ERA-8AEB202V: as R11#1 on sheet source_A; Part Number: ERA-8AEB202V; ComponentLink1Description: Datasheet; ComponentLink1URL: https://industrial.panasonic.com/cdbs/www-data/pdf/RDM0000/AOA0000C307.pdf; ComponentLink2Description: DigiKey Link; ComponentLink2URL: https://www.digikey.com/en/products/detail/panasonic-electronic-components/ERA-8AEB202V/3070866; Composition: Thin Film; Device Package: 1206 (3216 Metric); Features: Automotive AEC-Q200; Height - Seated (Max): 0.028" (0.70mm); LastUpdated: 2/9/2024 20:54:17; Lifecycle Status: Active; Minimum Order: 1; Number of Terminations: 2; Operating Temperature: -55°C ~ 155°C; Package / Case: 1206 (3216 Metric); Packaging: TapeAndReel; PartId: 34011; Part Status: Active; Price: 0.10; Ratings: AEC-Q200; Resistance: 2 kOhms; Series: ERA-8A; Size / Dimension: 0.126" L x 0.063" W (3.20mm x 1.60mm); Supplier 1: DigiKey; Supplier Part Number 1: P2.0KBCCT-ND; Supplier Device Package: 1206; Tolerance: ±0.1%; Value: 2 kOhms
R98 R100 = ERA-8AEB102V: as R12#1 on sheet source_A; Part Number: ERA-8AEB102V; ComponentLink1Description: Datasheet; ComponentLink1URL: https://industrial.panasonic.com/cdbs/www-data/pdf/RDM0000/AOA0000C307.pdf; ComponentLink2Description: DigiKey Link; ComponentLink2URL: https://www.digikey.com/en/products/detail/panasonic-electronic-components/ERA-8AEB102V/3070741; Composition: Thin Film; Device Package: 1206 (3216 Metric); Features: Automotive AEC-Q200; Height - Seated (Max): 0.028" (0.70mm); LastUpdated: 2/9/2024 20:54:17; Lifecycle Status: Active; Minimum Order: 1; Number of Terminations: 2; Operating Temperature: -55°C ~ 155°C; Package / Case: 1206 (3216 Metric); Packaging: TapeAndReel; PartId: 33986; Part Status: Active; Price: 0.10; Ratings: AEC-Q200; Resistance: 1 kOhms; Series: ERA-8A; Size / Dimension: 0.126" L x 0.063" W (3.20mm x 1.60mm); Supplier 1: DigiKey; Supplier Part Number 1: P1.0KBCCT-ND; Supplier Device Package: 1206; Tolerance: ±0.1%; Value: 1 kOhms
R147 R148 = RT1206FRE0710KL: as R60 on sheet source_A; Part Number: RT1206FRE0710KL; ComponentLink1Description: Datasheet; ComponentLink1URL: https://www.yageo.com/upload/media/product/productsearch/datasheet/rchip/PYu-RT_1-to-0.01_RoHS_L_11.pdf; ComponentLink2Description: DigiKey Link; ComponentLink2URL: https://www.digikey.com/en/products/detail/yageo/RT1206FRE0710KL/1082868; Composition: Thin Film; Device Package: 1206 (3216 Metric); Height - Seated (Max): 0.026" (0.65mm); LastUpdated: 7/25/2024 09:21:28; Lifecycle Status: Active; Minimum Order: 1; Number of Terminations: 2; Operating Temperature: -55°C ~ 155°C; Package / Case: 1206 (3216 Metric); Packaging: TapeAndReel; PartId: 38903; Part Status: Active; Price: 0.01; Resistance: 10 kOhms; Series: RT; Size / Dimension: 0.122" L x 0.063" W (3.10mm x 1.60mm); Supplier 1: DigiKey; Supplier Part Number 1: YAG1242CT-ND; Supplier Device Package: 1206; Tolerance: ±1%; Value: 10 kOhms
R149 R150 = RT1206FRE073K3L: as R62 on sheet source_A; Part Number: RT1206FRE073K3L; ComponentLink1Description: Datasheet; ComponentLink1URL: https://www.yageo.com/upload/media/product/productsearch/datasheet/rchip/PYu-RT_1-to-0.01_RoHS_L_12.pdf; ComponentLink2Description: DigiKey Link; ComponentLink2URL: https://www.digikey.com/en/products/detail/yageo/RT1206FRE073K3L/1083187; Composition: Thin Film; Device Package: 1206 (3216 Metric); Height - Seated (Max): 0.026" (0.65mm); LastUpdated: 7/25/2024 09:21:22; Lifecycle Status: Active; Minimum Order: 1; Number of Terminations: 2; Operating Temperature: -55°C ~ 155°C; Package / Case: 1206 (3216 Metric); Packaging: TapeAndReel; PartId: 58380; Part Status: Active; Price: 0.01; Resistance: 3.3 kOhms; Series: RT; Size / Dimension: 0.122" L x 0.063" W (3.10mm x 1.60mm); Supplier 1: DigiKey; Supplier Part Number 1: 13-RT1206FRE073K3LCT-ND; Supplier Device Package: 1206; Tolerance: ±1%; Value: 3.3 kOhms
U13 U14 = TLV9362: as U1#1 on sheet source_A; ComponentLink1Description: Datasheet; ComponentLink1URL: https://www.ti.com/lit/ds/symlink/tlv9362.pdf
Q14 Q15 = PHPT610030NPK: ComponentLink1Description: Datasheet; ComponentLink1URL: https://assets.nexperia.com/documents/data-sheet/PHPT610030NPK.pdf; ComponentLink2Description: Supplier; ComponentLink2URL: https://hr.mouser.com/ProductDetail/Nexperia/PHPT610030NPKX?qs=%252BRKXB2WKlSeoXKhT5DAScw%3D%3D